# Altium schematic sheet 12ziban.SchDoc
size A3
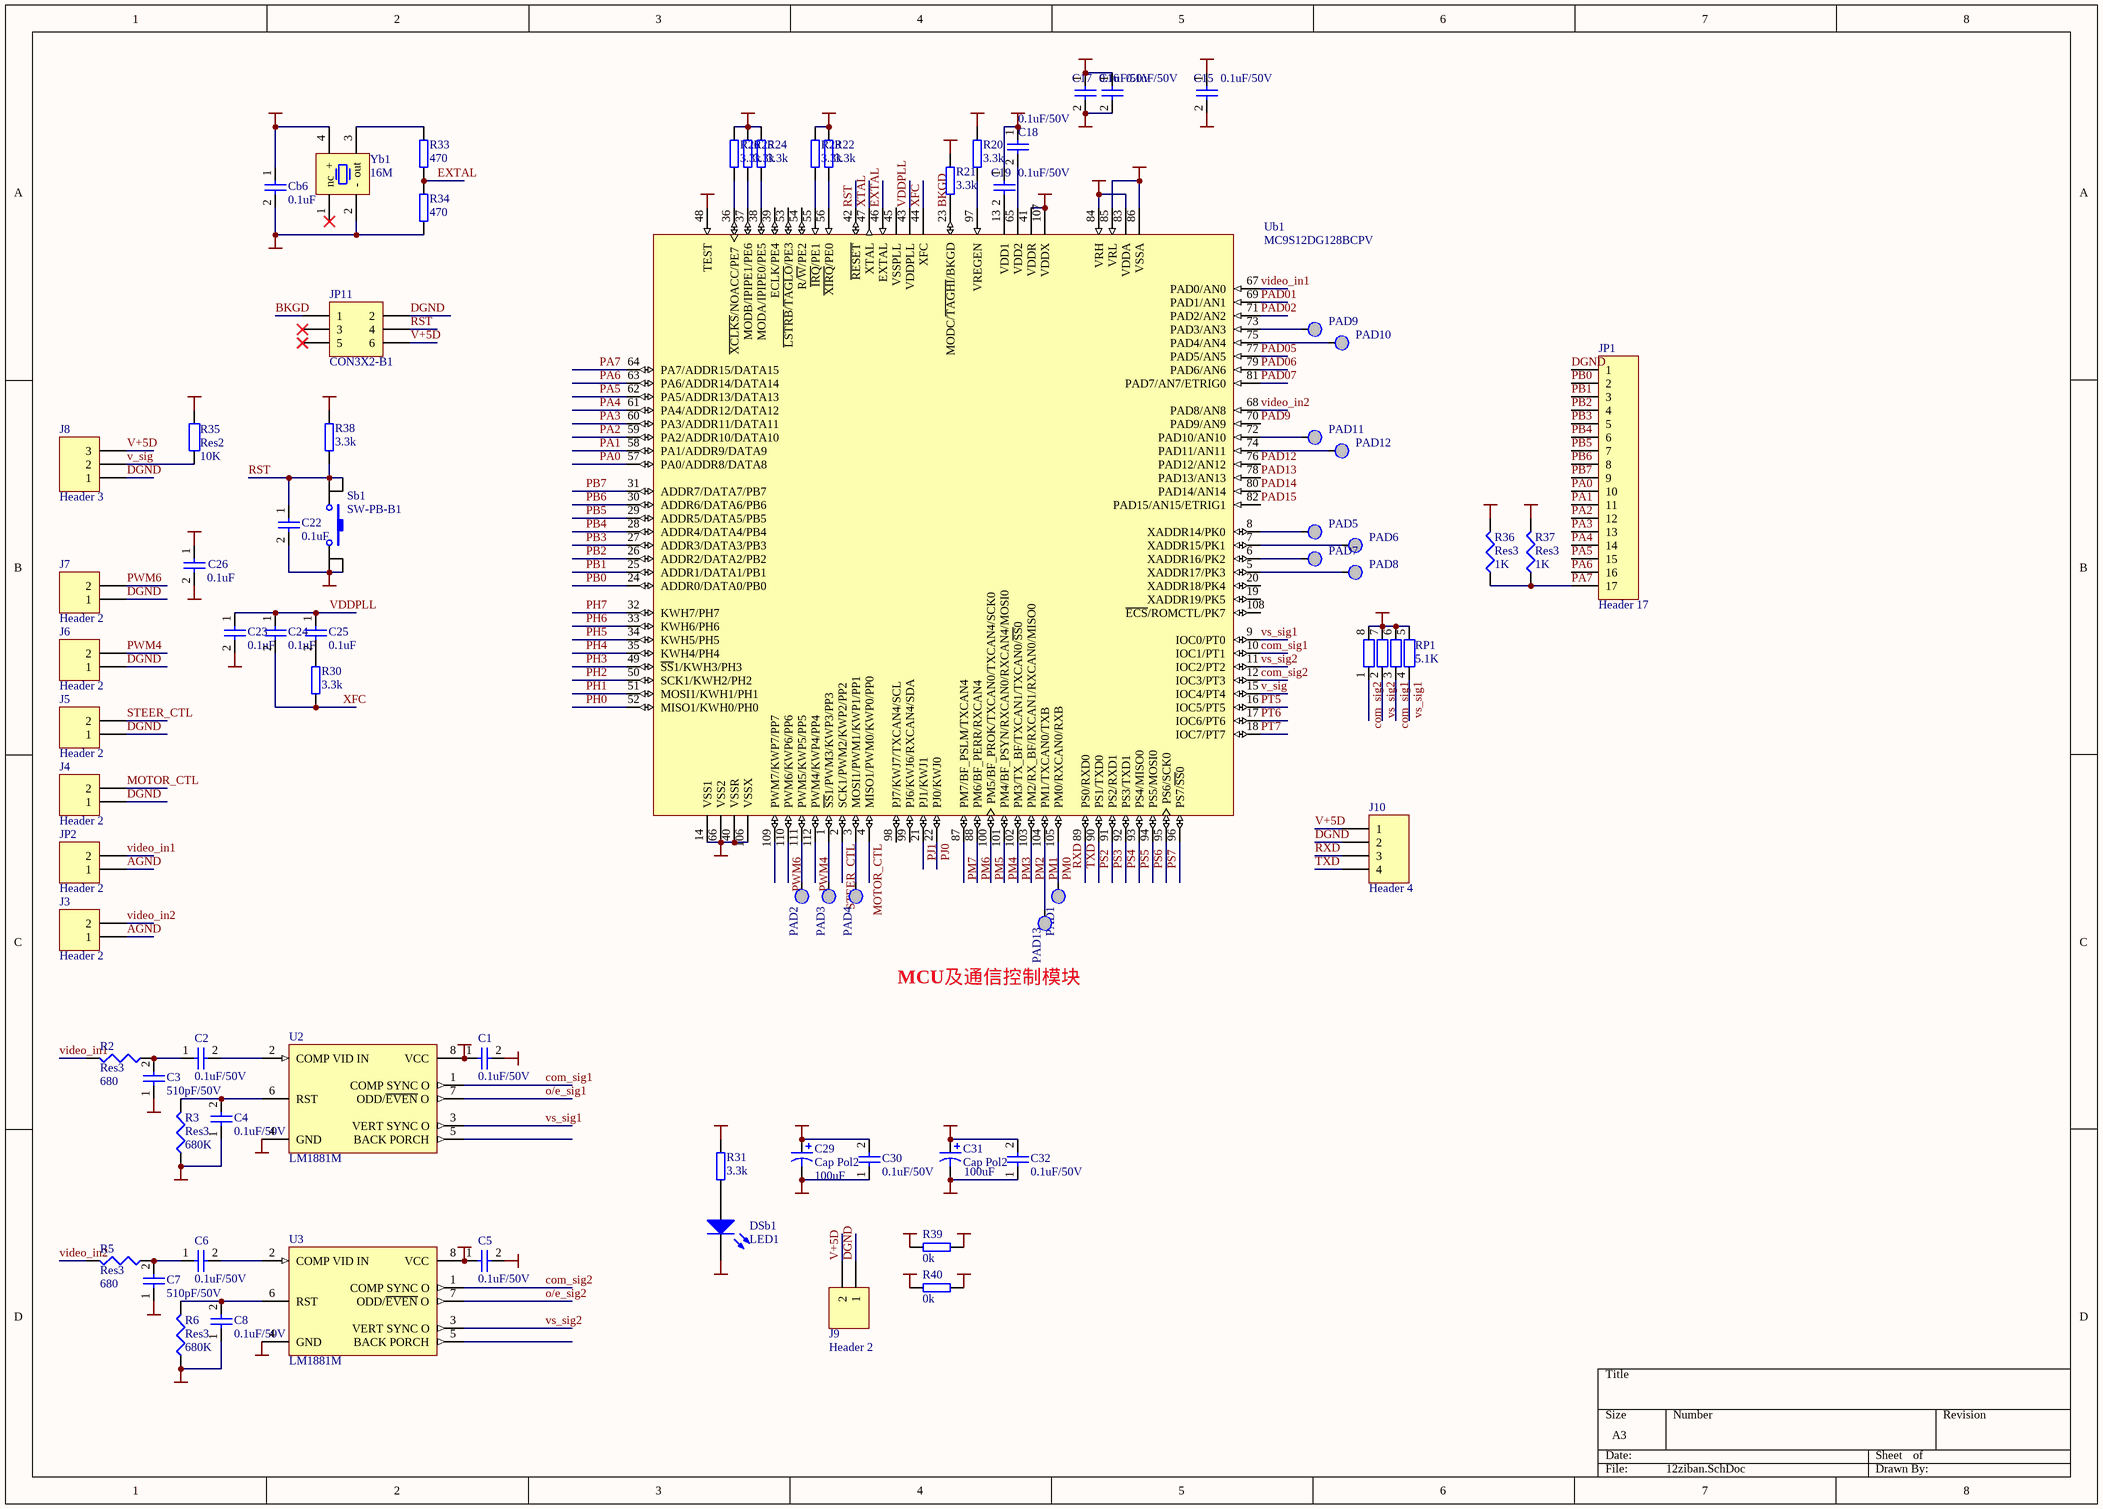
[diagram p0: 12ziban.SchDoc]

## Parts
C1  value 0.1uF/50V  [CR2012-0805]  (hidden comment: Cap)
C2  value 0.1uF/50V  [CR2012-0805]  (hidden comment: Cap)
C3  value 510pF/50V  [CR2012-0805]  (hidden comment: Cap)
C4  value 0.1uF/50V  [CR2012-0805]  (hidden comment: Cap)
C5  value 0.1uF/50V  [CR2012-0805]  (hidden comment: Cap)
C6  value 0.1uF/50V  [CR2012-0805]  (hidden comment: Cap)
C7  value 510pF/50V  [CR2012-0805]  (hidden comment: Cap)
C8  value 0.1uF/50V  [CR2012-0805]  (hidden comment: Cap)
C15  value 0.1uF/50V  [CR2012-0805]  (hidden comment: Cap)
C16  value 0.1uF/50V  [CR2012-0805]  (hidden comment: Cap)
C17  value 0.1uF/50V  [CR2012-0805]  (hidden comment: Cap)
C18  value 0.1uF/50V  [CR2012-0805]  (hidden comment: Cap)
C19  value 0.1uF/50V  [CR2012-0805]  (hidden comment: Cap)
C22  value 0.1uF  [CR2012-0805]  (hidden comment: Cap)
C23  value 0.1uF  [CR2012-0805]  (hidden comment: Cap)
C24  value 0.1uF  [CR2012-0805]  (hidden comment: Cap)
C25  value 0.1uF  [CR2012-0805]  (hidden comment: Cap)
C26  value 0.1uF  [CR2012-0805]  (hidden comment: Cap)
C29  Cap Pol2  value 100uF  [CR6332-2512]
C30  value 0.1uF/50V  [CR2012-0805]  (hidden comment: Cap)
C31  Cap Pol2  value 100uF  [C3216-1206-TA-YX1]
C32  value 0.1uF/50V  [CR2012-0805]  (hidden comment: Cap)
Cb6  value 0.1uF  [CR2012-0805]  (hidden comment: Cap)
DSb1  LED1  [CR2012-0805]
J3  Header 2  [HDR1X2]
J4  Header 2  [HDR1X2]
J5  Header 2  [HDR1X2]
J6  Header 2  [HDR1X2]
J7  Header 2  [HDR1X2]
J8  Header 3  [HDR1X3]
J9  Header 2  [HDR1X2]
J10  Header 4  [HDR1X4]
JP1  Header 17  [Ts1x17]
JP2  Header 2  [HDR1X2]
JP11  CON3X2-B1  [HDR2X3]
PAD1  PAD-YX1  [PAD-TEST-YX1]  (value not drawn)
PAD2  PAD-YX1  [PAD-TEST-YX1]  (value not drawn)
PAD3  PAD-YX1  [PAD-TEST-YX1]  (value not drawn)
PAD4  PAD-YX1  [PAD-TEST-YX1]  (value not drawn)
PAD5  PAD-YX1  [PAD-TEST-YX1]  (value not drawn)
PAD6  PAD-YX1  [PAD-TEST-YX1]  (value not drawn)
PAD7  PAD-YX1  [PAD-TEST-YX1]  (value not drawn)
PAD8  PAD-YX1  [PAD-TEST-YX1]  (value not drawn)
PAD9  PAD-YX1  [PAD-TEST-YX1]  (value not drawn)
PAD10  PAD-YX1  [PAD-TEST-YX1]  (value not drawn)
PAD11  PAD-YX1  [PAD-TEST-YX1]  (value not drawn)
PAD12  PAD-YX1  [PAD-TEST-YX1]  (value not drawn)
PAD13  PAD-YX1  [PAD-TEST-YX1]  (value not drawn)
R2  Res3  value 680  [CR2012-0805]
R3  Res3  value 680K  [CR2012-0805]
R5  Res3  value 680  [CR2012-0805]
R6  Res3  value 680K  [CR2012-0805]
R20  3.3k  [CR2012-0805]
R21  3.3k  [CR2012-0805]
R22  3.3k  [CR2012-0805]
R23  3.3k  [CR2012-0805]
R24  3.3k  [CR2012-0805]
R25  3.3k  [CR2012-0805]
R26  3.3k  [CR2012-0805]
R30  3.3k  [CR2012-0805]
R31  3.3k  [CR2012-0805]
R33  470  [CR2012-0805]
R34  470  [CR2012-0805]
R35  Res2  value 10K  [CR2012-0805]
R36  Res3  value 1K  [CR2012-0805]
R37  Res3  value 1K  [CR2012-0805]
R38  3.3k  [CR2012-0805]
R39  0k  [CR2012-0805]
R40  0k  [CR2012-0805]
RP1  value 5.1K  [RP4_YX1]  (hidden comment: RESP4_YX1)
Sb1  SW-PB-B1  [SW2-4-B1]
U2  LM1881M  [SO-8]
U3  LM1881M  [SO-8]
Ub1  MC9S12DG128BCPV  [987-01]
Yb1  value 16M  [XYT]  (hidden comment: XTAL)

## Nets
AGND: C1.2 C3.1 C4.1 C5.2 C7.1 C8.1 C15.2 C31.2 C32.1 J3.1 JP2.1 R3.1 R6.1 R40.1 U2.4(GND) U3.4(GND) Ub1.85(VRL) Ub1.86(VSSA)
DGND: C16.2 C17.2 C18.1 C19.1 C22.2 C23.2 C26.2 C29.2 C30.1 Cb6.2 DSb1.2(K) J4.1 J5.1 J6.1 J7.1 J8.1 J9.1 J10.2 JP1.1 JP11.2 R24.1 R25.1 R26.1 R34.2 R37.2 R40.2 Sb1.2 Sb1.3 Ub1.14(VSS1) Ub1.40(VSSR) Ub1.48(TEST) Ub1.66(VSS2) Ub1.106(VSSX) Yb1.2(-)
V+5A: C1.1 C5.1 C15.1 C31.1 C32.2 R39.1 U2.8(VCC) U3.8(VCC) Ub1.83(VDDA) Ub1.84(VRH)
V+5D: C16.1 C17.1 C26.1 C29.1 C30.2 Cb6.1 J8.3 J9.2 J10.1 JP11.6 R20.1 R21.1 R22.1 R23.1 R31.2 R35.2 R36.2 R38.2 R39.2 RP1.5 RP1.6 RP1.7 RP1.8 Ub1.41(VDDR) Ub1.107(VDDX) Yb1.4(+)
BKGD: JP11.1 R21.2 Ub1.23(MODC/~{TAGHI}/BKGD)
com_sig1: RP1.3 U2.1(COMP_SYNC_O) Ub1.10(IOC1/PT1)
com_sig2: RP1.1 U3.1(COMP_SYNC_O) Ub1.12(IOC3/PT3)
EXTAL: R33.2 R34.1 Ub1.46(EXTAL)
MOTOR_CTL: J4.2 Ub1.4(MISO1/PWM0/KWP0/PP0)
o/e_sig1: U2.7(ODD/~{EVEN}_O)
o/e_sig2: U3.7(ODD/~{EVEN}_O)
PA0: JP1.10 Ub1.57(PA0/ADDR8/DATA8)
PA1: JP1.11 Ub1.58(PA1/ADDR9/DATA9)
PA2: JP1.12 Ub1.59(PA2/ADDR10/DATA10)
PA3: JP1.13 Ub1.60(PA3/ADDR11/DATA11)
PA4: JP1.14 Ub1.61(PA4/ADDR12/DATA12)
PA5: JP1.15 Ub1.62(PA5/ADDR13/DATA13)
PA6: JP1.16 Ub1.63(PA6/ADDR14/DATA14)
PA7: JP1.17 R36.1 R37.1 Ub1.64(PA7/ADDR15/DATA15)
PAD01: Ub1.69(PAD1/AN1)
PAD02: Ub1.71(PAD2/AN2)
PAD05: Ub1.77(PAD5/AN5)
PAD06: Ub1.79(PAD6/AN6)
PAD07: Ub1.81(PAD7/AN7/ETRIG0)
PAD9: Ub1.70(PAD9/AN9)
PAD12: Ub1.76(PAD12/AN12)
PAD13: Ub1.78(PAD13/AN13)
PAD14: Ub1.80(PAD14/AN14)
PAD15: Ub1.82(PAD15/AN15/ETRIG1)
PB0: JP1.2 Ub1.24(ADDR0/DATA0/PB0)
PB1: JP1.3 Ub1.25(ADDR1/DATA1/PB1)
PB2: JP1.4 Ub1.26(ADDR2/DATA2/PB2)
PB3: JP1.5 Ub1.27(ADDR3/DATA3/PB3)
PB4: JP1.6 Ub1.28(ADDR4/DATA4/PB4)
PB5: JP1.7 Ub1.29(ADDR5/DATA5/PB5)
PB6: JP1.8 Ub1.30(ADDR6/DATA6/PB6)
PB7: JP1.9 Ub1.31(ADDR7/DATA7/PB7)
PH0: Ub1.52(MISO1/KWH0/PH0)
PH1: Ub1.51(MOSI1/KWH1/PH1)
PH2: Ub1.50(SCK1/KWH2/PH2)
PH3: Ub1.49(~{SS}1/KWH3/PH3)
PH4: Ub1.35(KWH4/PH4)
PH5: Ub1.34(KWH5/PH5)
PH6: Ub1.33(KWH6/PH6)
PH7: Ub1.32(KWH7/PH7)
PJ0: Ub1.22(PJ0/KWJ0)
PJ1: Ub1.21(PJ1/KWJ1)
PM0: PAD1.1(A) Ub1.105(PM0/RXCAN0/RXB)
PM1: PAD13.1(A) Ub1.104(PM1/TXCAN0/TXB)
PM2: Ub1.103(PM2/RX_BF/RXCAN1/RXCAN0/MISO0)
PM3: Ub1.102(PM3/TX_BF/TXCAN1/TXCAN0/~{SS}0)
PM4: Ub1.101(PM4/BF_PSYN/RXCAN0/RXCAN4/MOSI0)
PM5: Ub1.100(PM5/BF_PROK/TXCAN0/TXCAN4/SCK0)
PM6: Ub1.88(PM6/BF_PERR/RXCAN4)
PM7: Ub1.87(PM7/BF_PSLM/TXCAN4)
PS2: Ub1.91(PS2/RXD1)
PS3: Ub1.92(PS3/TXD1)
PS4: Ub1.93(PS4/MISO0)
PS5: Ub1.94(PS5/MOSI0)
PS6: Ub1.95(PS6/SCK0)
PS7: Ub1.96(PS7/~{SS}0)
PT5: Ub1.16(IOC5/PT5)
PT6: Ub1.17(IOC6/PT6)
PT7: Ub1.18(IOC7/PT7)
PWM4: J6.2 Ub1.112(PWM4/KWP4/PP4)
PWM6: J7.2 Ub1.110(PWM6/KWP6/PP6)
RST: C22.1 JP11.4 R38.1 Sb1.1 Sb1.4 Ub1.42(~{RESET})
RXD: J10.3 Ub1.89(PS0/RXD0)
STEER_CTL: J5.2 Ub1.2(SCK1/PWM2/KWP2/PP2)
TXD: J10.4 Ub1.90(PS1/TXD0)
v_sig: J8.2 R35.1 Ub1.15(IOC4/PT4)
VDDPLL: C23.1 C24.1 C25.1 Ub1.43(VDDPLL)
video_in1: JP2.2 R2.2 Ub1.67(PAD0/AN0)
video_in2: J3.2 R5.2 Ub1.68(PAD8/AN8)
vs_sig1: RP1.4 U2.3(VERT_SYNC_O) Ub1.9(IOC0/PT0)
vs_sig2: RP1.2 U3.3(VERT_SYNC_O) Ub1.11(IOC2/PT2)
XFC: C24.2 R30.1 Ub1.44(XFC)
XTAL: Ub1.47(XTAL)
NetC2_1: C2.1 C3.2 R2.1
NetC2_2: C2.2 U2.2(COMP_VID_IN)
NetC4_2: C4.2 R3.2 U2.6(RST)
NetC6_1: C6.1 C7.2 R5.1
NetC6_2: C6.2 U3.2(COMP_VID_IN)
NetC8_2: C8.2 R6.2 U3.6(RST)
NetC18_2: C18.2 Ub1.65(VDD2)
NetC19_2: C19.2 Ub1.13(VDD1)
NetC25_2: C25.2 R30.2
NetDSb1_1: DSb1.1(A) R31.1
NetPAD2_1: PAD2.1(A) Ub1.111(PWM5/KWP5/PP5)
NetPAD3_1: PAD3.1(A) Ub1.1(~{SS}1/PWM3/KWP3/PP3)
NetPAD4_1: PAD4.1(A) Ub1.3(MOSI1/PWM1/KWP1/PP1)
NetPAD5_1: PAD5.1(A) Ub1.8(XADDR14/PK0)
NetPAD6_1: PAD6.1(A) Ub1.7(XADDR15/PK1)
NetPAD7_1: PAD7.1(A) Ub1.6(XADDR16/PK2)
NetPAD8_1: PAD8.1(A) Ub1.5(XADDR17/PK3)
NetPAD9_1: PAD9.1(A) Ub1.73(PAD3/AN3)
NetPAD10_1: PAD10.1(A) Ub1.75(PAD4/AN4)
NetPAD11_1: PAD11.1(A) Ub1.72(PAD10/AN10)
NetPAD12_1: PAD12.1(A) Ub1.74(PAD11/AN11)
NetR20_2: R20.2 Ub1.97(VREGEN)
NetR22_2: R22.2 Ub1.56(~{XIRQ}/PE0)
NetR23_2: R23.2 Ub1.55(~{IRQ}/PE1)
NetR24_2: R24.2 Ub1.38(MODA/IPIPE0/PE5)
NetR25_2: R25.2 Ub1.37(MODB/IPIPE1/PE6)
NetR26_2: R26.2 Ub1.36(~{XCLKS}/NOACC/PE7)
NetR33_1: R33.1 Yb1.3(out)

Not connected (* = marked no-connect by the designer): JP11 3* 5*; U2 5(BACK_PORCH); U3 5(BACK_PORCH); Ub1 19(XADDR19/PK5) 20(XADDR18/PK4) 39(ECLK/PE4) 45(VSSPLL) 53(~{LSTRB}/~{TAGLO}/PE3) 54(R/~{W}/PE2) 98(PJ7/KWJ7/TXCAN4/SCL) 99(PJ6/KWJ6/RXCAN4/SDA) 108(~{ECS}/ROMCTL/PK7) 109(PWM7/KWP7/PP7); Yb1 1(nc)*

## Notes on the sheet
- (near PAD13) MCU及通信控制模块

## Library data of the parts
C1-C8 C15-C19 C23-C25 C30 C32 Cb6 = Cap: Capacitor; Manufacturer: Generic Components; Class: Passive; Published: 08/06/2000; Publisher: Altium Hobart Technology Centre; SubClass: Capacitor
C22 C26 = Cap: Capacitor; Published: 8-Jun-2000; Revision: July-2002: Re-released for DXP Platform.; Publisher: Altium Limited
C29 C31 = Cap Pol2: Polarized Capacitor (Axial); Published: 8-Jun-2000; Revision: July-2002: Re-released for DXP Platform.; Publisher: Altium Limited
DSb1 = LED1: Typical RED GaAs LED; Published: 8-Jun-2000; Revision: July-2002: Re-released for DXP Platform.; Publisher: Altium Limited
J3-J7 J9 JP2 = Header 2: Header, 2-Pin; Revision: 17-Jul-2002: Re-released for DXP Platform.; Publisher: Altium Limited
J8 = Header 3: Header, 3-Pin; Revision: 17-Jul-2002: Re-released for DXP Platform.; Publisher: Altium Limited
J10 = Header 4: Header, 4-Pin; Revision: 17-Jul-2002: Re-released for DXP Platform.; Publisher: Altium Limited
JP1 = Header 17: Header, 17-Pin; Revision: 17-Jul-2002: Re-released for DXP Platform.; Publisher: Altium Limited
JP11 = CON3X2-B1: Header, 6-Pin, Dual row; Manufacturer: Generic Components; Class: Connector
PAD1-PAD13 = PAD-YX1: Electrical Bell; Manufacturer: Generic Components; Published: 1999
R2 R3 R5 R6 R36 R37 = Res3: Resistor; Published: 8-Jun-2000; Revision: July-2002: Re-released for DXP Platform.; Publisher: Altium Limited
R20-R26 R30 R31 R33 R34 R38-R40 = RES2
R35 = Res2: Resistor; Published: 8-Jun-2000; Revision: July-2002: Re-released for DXP Platform.; Publisher: Altium Limited
RP1 = RESP4_YX1: Resistor; Manufacturer: Generic Components; Class: Passive; Published: 08/06/2000; Publisher: Altium Hobart Technology Centre; SubClass: Resistor
Sb1 = SW-PB-B1: Switch; Manufacturer: Generic Components; Published: 1999
U2 U3 = LM1881M: Video Sync Separator; Package Information: Latest Revision: Sep-1997; Code - JEDEC: MS-012-AA; Code - IPC: SO8; Published: 15-Apr-2002; Datasheet: Latest Revision: Feb-1995; Package Reference: M08A; Publisher: Altium Limited
Ub1 = MC9S12DG128BCPV: 16-Bit Microcontroller; Package Information: Latest Revision: rev3.1, Nov-2000; Published: 21-Mar-2003; Datasheet: Latest Revision: 16-Aug-2002; Package Reference: 987-01; Publisher: Altium Limited
Yb1 = XTAL-YX2: Crystal Oscillator; Manufacturer: Generic Components; Published: 08/06/2000; Publisher: Altium Hobart Technology Centre; Class: Oscillator; SubClass: Crystal Oscillator